# Altium schematic sheet Power.SchDoc
size A4; SheetNumber: 2; SheetTotal: 8
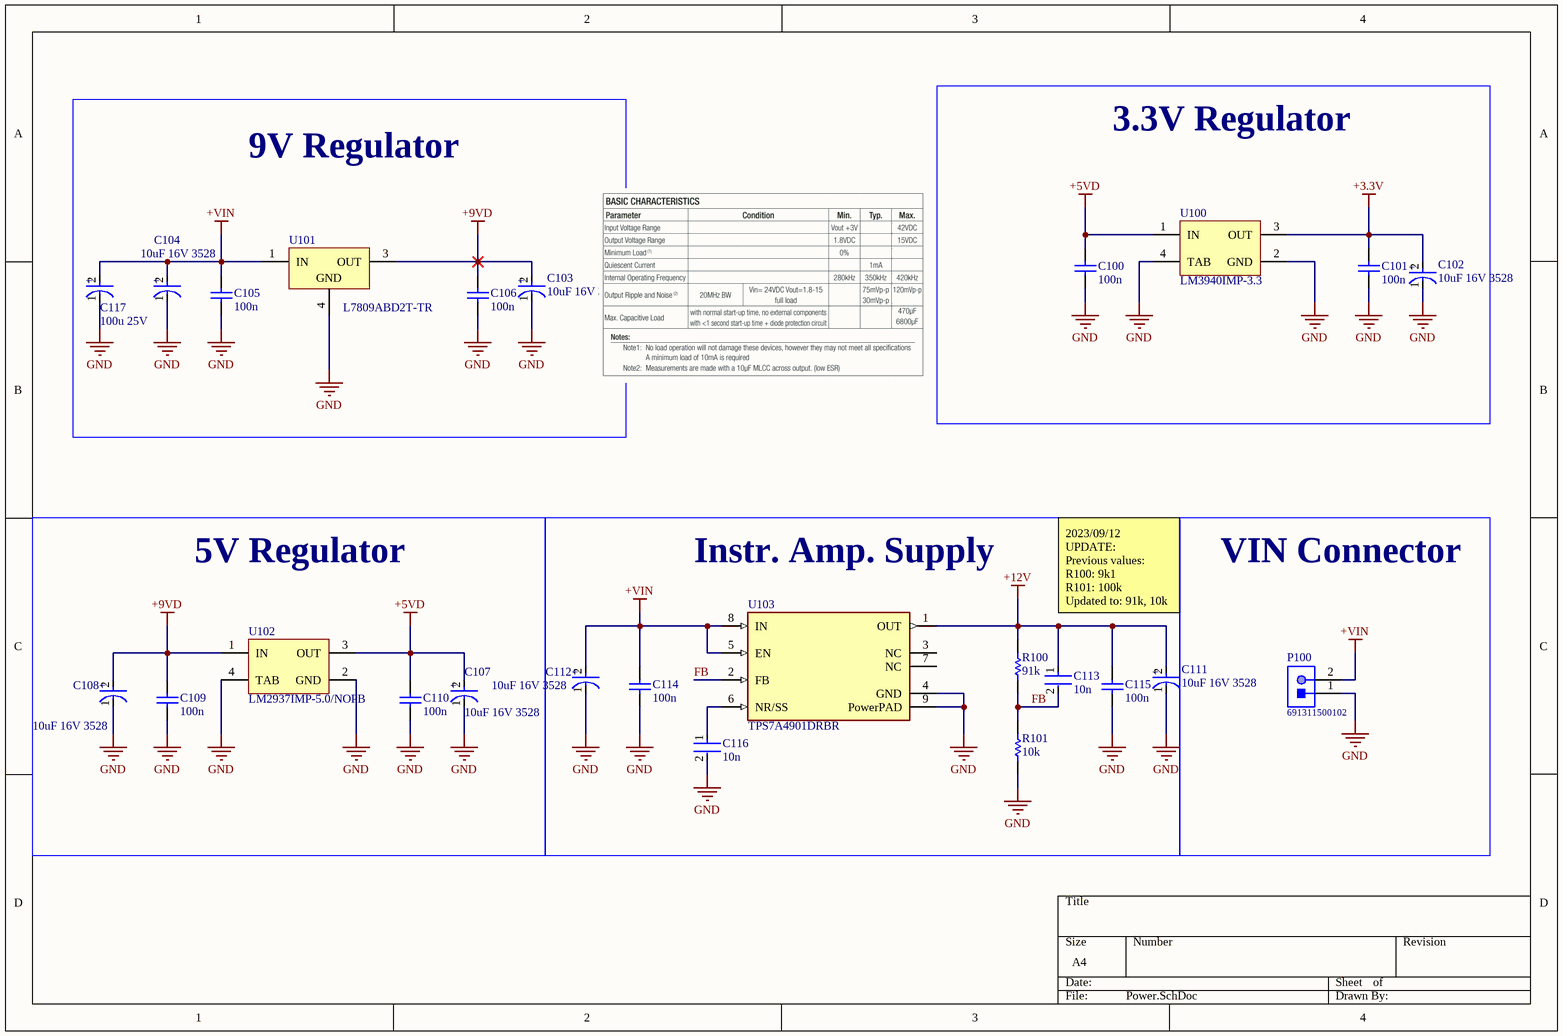
[diagram p0: Power.SchDoc]

## Parts
C100  100n  [SAMS-C0603-2_M]
C101  100n  [SAMS-C0603-2_M]
C102  10uF 16V 3528  [FP-T491B106K020AT-MFG]
C103  10uF 16V 3528  [FP-T491B106K020AT-MFG]
C104  10uF 16V 3528  [FP-T491B106K020AT-MFG]
C105  100n  [SAMS-C0603-2_M]
C106  100n  [SAMS-C0603-2_M]
C107  10uF 16V 3528  [FP-T491B106K020AT-MFG]
C108  10uF 16V 3528  [FP-T491B106K020AT-MFG]
C109  100n  [SAMS-C0603-2_M]
C110  100n  [SAMS-C0603-2_M]
C111  10uF 16V 3528  [FP-T491B106K020AT-MFG]
C112  10uF 16V 3528  [FP-T491B106K020AT-MFG]
C113  10n  [FP-C0603C-CF-MFG]
C114  100n  [SAMS-C0603-2_M]
C115  100n  [SAMS-C0603-2_M]
C116  10n  [FP-C0603C-CF-MFG]
C117  100u 25V  [FP-T491X107K025AT-MFG]
P100  691311500102  [691311500102]
R100  91k  [RESC1608X55X30ML15T15]
R101  10k  [RESC1608X55X30ML15T15]
U100  LM3940IMP-3.3  [DCY0004A_L]
U101  L7809ABD2T-TR  [TO-263_N]
U102  LM2937IMP-5.0/NOPB  [DCY0004A_L]
U103  TPS7A4901DRBR  [FP-DRB0008A-MFG]

## Blocks framed on the sheet
3.3V Regulator: C100-C102 U100
9V Regulator: C103-C106 C117 U101
5V Regulator: C107-C110 U102
Instr. Amp. Supply: C111-C116 R100 R101 U103
VIN Connector: P100

## Nets
+3.3V: C101.2 C102.2(A) U100.3(OUT)
+5VD: C100.2 C107.2(A) C110.2 U100.1(IN) U102.3(OUT)
+9VD: C103.2(A) C106.2 C108.2(A) C109.2 U101.3(OUT) U102.1(IN)
+12V: C111.2(A) C113.1 C115.2 R100.2 U103.1(OUT)
+VIN: C104.2(A) C105.2 C112.2(A) C114.2 C117.2(A) P100.2 U101.1(IN) U103.5(EN) U103.8(IN)
GND: C100.1 C101.1 C102.1(C) C103.1(C) C104.1(C) C105.1 C106.1 C107.1(C) C108.1(C) C109.1 C110.1 C111.1(C) C112.1(C) C114.1 C115.1 C116.2 C117.1(C) P100.1 R101.1 U100.2(GND) U100.4(TAB) U101.4(GND) U102.2(GND) U102.4(TAB) U103.4(GND) U103.9(PowerPAD)
FB: C113.2 R100.1 R101.2 U103.2(FB)
NetC116_1: C116.1 U103.6(NR/SS)

Not connected (* = marked no-connect by the designer): U103 3(NC) 7(NC)

## Notes on the sheet
- 2023/09/12 UPDATE:
  Previous values:
  R100: 9k1
  R101: 100k
  Updated to: 91k, 10k
- (in symbol CMP-2000-07191-2) +
- (in symbol CMP-2000-07204-2) +

## Library data of the parts
C100 C101 C105 C106 C109 C110 C114 C115 = CMP-2000-05332-1: Multi-layer Ceramic Capacitor, -55 to 125 degC, 2-Pin SMD (0603), RoHS, Tape and Reel; Manufacturer: Samsung Electro-Mechanics; Capacitance: 0.1µF; Rated Voltage: 50V; Dielectric: X7R; Tolerance (%): ±10%; Case Size/Dimension: 0603; Datasheet URL: https://datasheet.ciiva.com/29198/456651-da-01-en-vs-kondensator-0605-29198839.pdf; Manufacturer URL: http://www.samsungsem.com/global/index.jsp; Datasheet Version: Nov-10
C102-C104 C107 C108 C111 C112 = CMP-2000-07191-2: CAP TANT 10UF 10% 20V 1411; Polarity: Polar; Life (Hours): 2000Hour; Dissipation Factor: 6%; Leakage Current: 2uA; Dielectric Material: Tantalum; Ripple Current: 201mA; ESR (Equivalent Series Resistance): 2.1R; Weight: 0.002293oz; Max Operating Temperature: 125°C; Failure Rate: 0.001%; Tolerance: 10%; Case Code (Metric): 3528; Case Code (Imperial): 1411; Number of Pins: 2; Case/Package: 1411; Width: 2.8mm; Height: 1.9mm; Voltage Rating: 20V; Voltage: 20V; Lead Free: Lead Free; Features: General Purpose; Radiation Hardening: No; Min Operating Temperature: -55°C; Length: 3.5mm; Mount: Surface Mount; Depth: 2.8mm; Voltage Rating (DC): 20V; Termination: SMD/SMT; Package Quantity: 1; Capacitance: 10uF; Packaging: Tape and Reel; RoHS Compliant: Yes; REACH SVHC: No SVHC; Height - Seated (Max): 0.083inch
C113 C116 = CMP-2006-03038-2: CAP CER 10000PF 200V X7R 0603; Manufacturer: KEMET; Manufacturer Part Number: C0603C103K2RACTU; Material: Ceramic; Value: 10,000 pF; Temperature Coefficient: 30ppm/°C; Tolerance: 0.1; Automotive Grade: Grade 1; Voltage Rating: 200 V; ComponentLink2Description: Datasheet; Package: C0603C-CF; Device Class L2: Capacitors; Mouser Description: Multilayer Ceramic Capacitors MLCC - SMD/SMT 200volts 10000pF X7R 10%; Device Class L3: Ceramic Capacitors; Temperature Range Low: -55°C; Category: Cap; Device Class L1: Passive Components; Lead Free: Yes; Octopart: https://octopart.com/c0603c103k2ractu-kemet-1061947; ComponentLink2URL: https://api.kemet.com/component-edge/download/datasheet/C0603C100J5GACAUTO.pdf; Temperature Characteristic: X7R; Temperature: -55°C to +125°C; Automotive: Yes; Temperature Range High: +125°C; Digikey Description: CAP CER 10000PF 200V X7R 0603; Height: 0.87mm; RoHS: TRUE; Capacitance: 10,000 pF
C117 = CMP-2000-07204-2: CAP TANT 100UF 10% 25V 2917; Leakage Current: 25uA; Ripple Current: 742mA; Polarity: Polar; Dissipation Factor: 8%; Life (Hours): 2000Hour; Dielectric Material: Tantalum; ESR (Equivalent Series Resistance): 300mR; Length: 7.3mm; RoHS Compliant: No; Failure Rate: 0.001%; REACH SVHC: No SVHC; Tolerance: 10%; Mount: Surface Mount; Height - Seated (Max): 0.169inch; Features: General Purpose; Height: 4mm; Package Quantity: 1; Case Code (Metric): 7343; Max Operating Temperature: 125°C; Number of Pins: 2; Radiation Hardening: No; Lead Free: Lead Free; Capacitance: 100uF; Termination: SMD/SMT; Voltage Rating: 25V; Series: T491; Depth: 4.3mm; Construction: Flat; Case/Package: 2917; Min Operating Temperature: -55°C; Voltage Rating (DC): 25V; Width: 4.3mm; Packaging: Tape and Reel; Case Code (Imperial): 2917; Voltage: 25V
P100 = CMP-1502-02146-1: Serie 311 - 5.08mm Close Vertical PCB Header WR-TBL, 2 pin; Manufacturer: Wurth Elektronik; Pin Number: 2; Gender: Male; Operating Temperature: -40to105degC; Package Reference: 691311500102; Packaging: Box; Part Number: 691311500102; Publisher: WurthElektronik; Datasheet URL: http://katalog.we-online.de/em/datasheet/6913115001xx.pdf; Mounting Technology: THT; Pitch: 5.08mm; Manufacturer URL: http://www.we-online.de
R100 = CMP-2000-00683-1: Manufacturer: Panasonic; Part Number: ERJ-3EKF9100V
R101 = CMP-2000-00182-1: Part Number: ERJ-3EKF1003V; Manufacturer: Panasonic
U100 = CMP-0062-01793-3: 1A Low Dropout Regulator for 5V to 3.3V Conversion, 4-pin SOT-223; Manufacturer: Texas Instruments; PackageTopMarking: XYTT*L52B; CompType: LDO IC; PowerWise: N; Code_JEDEC: TO-261-AA; PackageDescription: Molded SOT-223, 6.50 x 3.56 x 1.6mm Body, 4 Lead, 2.3mm Pitch; PinCount: 4; ComponentLink1Description: Datasheet URL; PackageReference: DCY0004A; Code_IPC: SOT223-4; ComponentLink1URL: http://www.ti.com/general/docs/lit/getliterature.tsp?genericPartNumber=LM3940&fileType=pdf; RoHS: N
U101 = CMP-0244-00211-1: Positive Voltage Regulator, 3-Pin D2PAK, Tape and Reel; ComponentLink2URL: http://www.st.com/internet/com/TECHNICAL_RESOURCES/TECHNICAL_LITERATURE/DATASHEET/CD00000444.pdf; PackageDescription: 3-Pin Transistor Outline Package 2.54 mm Pitch, 15.4 mm Lead Span (D2PAK); DatasheetVersion: 16/11/2011; PackageReference: TO-263; PackageVersion: 2011; ComponentLink1Description: Manufacturer URL; ComponentLink1URL: http://www.st.com; ComponentLink2Description: Datasheet
U102 = CMP-0062-01757-3: 500 mA Low Dropout Regulator, 4-pin SOT-223, Pb-Free; Manufacturer: Texas Instruments; PowerWise: N; CompType: LDO IC; PackageTopMarking: XYTT*L71B; Code_IPC: SOT223-4; ComponentLink1Description: Datasheet URL; ComponentLink1URL: http://www.ti.com/general/docs/lit/getliterature.tsp?genericPartNumber=LM2937&fileType=pdf; PackageDescription: Molded SOT-223, 6.50 x 3.56 x 1.6mm Body, 4 Lead, 2.3mm Pitch; PinCount: 4; RoHS: Y; PackageReference: DCY0004A; Code_JEDEC: TO-261-AA
U103 = CMP-04917-000048-2: None; Polarity: Positive; Max Input Voltage: 35V; Output Type: Adjustable; Output Voltage: 33V; Number of Regulators: 1; Quiescent Current: 100uA; Output Current: 150mA; Accuracy: 1.5%; Dropout Voltage: 333mV; Min Current Limit: 220mA; Min Input Voltage: 3V; Max Operating Temperature: 125°C; Min Operating Temperature: -40°C; Lead Free: Lead Free; Number of Pins: 8; Mount: Surface Mount; Packaging: Cut Tape; Number of Outputs: 1; RoHS Compliant: Yes; Contact Plating: Gold; Max Output Current: 150mA